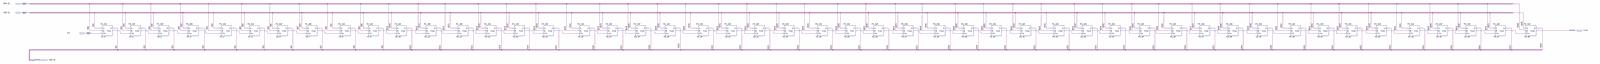
[diagram p0: schematic sheet, whole]
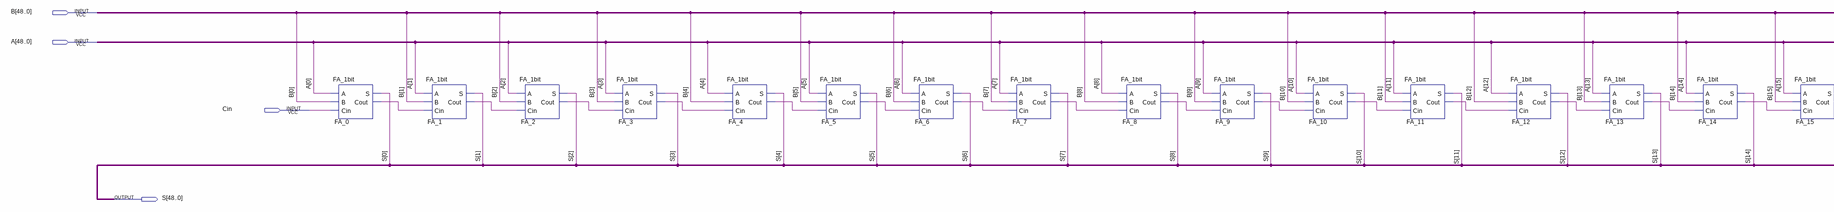
[diagram p1: schematic sheet, left part]
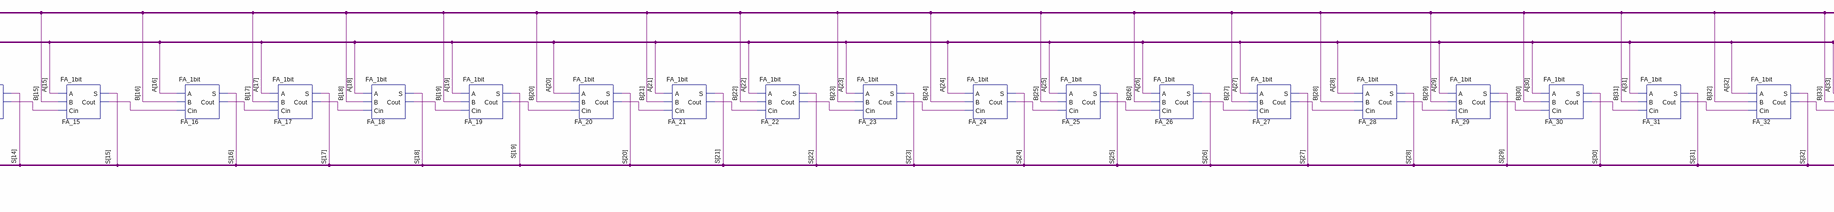
[diagram p2: schematic sheet, centre part]
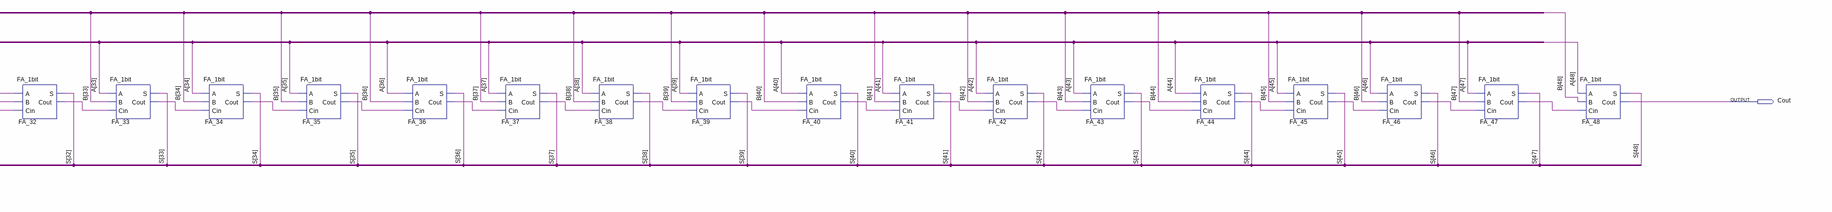
[diagram p3: schematic sheet, right part]
// Quartus schematic FA_49bit.bdf as structural Verilog: 49 symbols, 5 pins
module FA_49bit (
  input  [48:0] B,
  input  [48:0] A,
  input  Cin,
  output Cout,
  output [48:0] S
);

  wire FA_0_cout, FA_1_cout, FA_2_cout, FA_3_cout, FA_4_cout, FA_5_cout, FA_6_cout, FA_7_cout, FA_8_cout,
       FA_9_cout, FA_10_cout, FA_11_cout, FA_12_cout, FA_13_cout, FA_14_cout, FA_15_cout, FA_16_cout,
       FA_17_cout, FA_18_cout, FA_19_cout, FA_20_cout, FA_21_cout, FA_22_cout, FA_23_cout, FA_24_cout,
       FA_25_cout, FA_26_cout, FA_27_cout, FA_28_cout, FA_29_cout, FA_30_cout, FA_31_cout, FA_32_cout,
       FA_33_cout, FA_34_cout, FA_35_cout, FA_36_cout, FA_37_cout, FA_38_cout, FA_39_cout, FA_40_cout,
       FA_41_cout, FA_42_cout, FA_43_cout, FA_44_cout, FA_45_cout, FA_46_cout, FA_47_cout;

  FA_1bit FA_0 (.A(A[0]), .B(B[0]), .Cin(Cin), .S(S[0]), .Cout(FA_0_cout));
  FA_1bit FA_1 (.A(A[1]), .B(B[1]), .Cin(FA_0_cout), .S(S[1]), .Cout(FA_1_cout));
  FA_1bit FA_2 (.A(A[2]), .B(B[2]), .Cin(FA_1_cout), .S(S[2]), .Cout(FA_2_cout));
  FA_1bit FA_3 (.A(A[3]), .B(B[3]), .Cin(FA_2_cout), .S(S[3]), .Cout(FA_3_cout));
  FA_1bit FA_4 (.A(A[4]), .B(B[4]), .Cin(FA_3_cout), .S(S[4]), .Cout(FA_4_cout));
  FA_1bit FA_5 (.A(A[5]), .B(B[5]), .Cin(FA_4_cout), .S(S[5]), .Cout(FA_5_cout));
  FA_1bit FA_6 (.A(A[6]), .B(B[6]), .Cin(FA_5_cout), .S(S[6]), .Cout(FA_6_cout));
  FA_1bit FA_7 (.A(A[7]), .B(B[7]), .Cin(FA_6_cout), .S(S[7]), .Cout(FA_7_cout));
  FA_1bit FA_8 (.A(A[8]), .B(B[8]), .Cin(FA_7_cout), .S(S[8]), .Cout(FA_8_cout));
  FA_1bit FA_9 (.A(A[9]), .B(B[9]), .Cin(FA_8_cout), .S(S[9]), .Cout(FA_9_cout));
  FA_1bit FA_10 (.A(A[10]), .B(B[10]), .Cin(FA_9_cout), .S(S[10]), .Cout(FA_10_cout));
  FA_1bit FA_11 (.A(A[11]), .B(B[11]), .Cin(FA_10_cout), .S(S[11]), .Cout(FA_11_cout));
  FA_1bit FA_12 (.A(A[12]), .B(B[12]), .Cin(FA_11_cout), .S(S[12]), .Cout(FA_12_cout));
  FA_1bit FA_13 (.A(A[13]), .B(B[13]), .Cin(FA_12_cout), .S(S[13]), .Cout(FA_13_cout));
  FA_1bit FA_14 (.A(A[14]), .B(B[14]), .Cin(FA_13_cout), .S(S[14]), .Cout(FA_14_cout));
  FA_1bit FA_15 (.A(A[15]), .B(B[15]), .Cin(FA_14_cout), .S(S[15]), .Cout(FA_15_cout));
  FA_1bit FA_16 (.A(A[16]), .B(B[16]), .Cin(FA_15_cout), .S(S[16]), .Cout(FA_16_cout));
  FA_1bit FA_17 (.A(A[17]), .B(B[17]), .Cin(FA_16_cout), .S(S[17]), .Cout(FA_17_cout));
  FA_1bit FA_18 (.A(A[18]), .B(B[18]), .Cin(FA_17_cout), .S(S[18]), .Cout(FA_18_cout));
  FA_1bit FA_19 (.A(A[19]), .B(B[19]), .Cin(FA_18_cout), .S(S[19]), .Cout(FA_19_cout));
  FA_1bit FA_20 (.A(A[20]), .B(B[20]), .Cin(FA_19_cout), .S(S[20]), .Cout(FA_20_cout));
  FA_1bit FA_21 (.A(A[21]), .B(B[21]), .Cin(FA_20_cout), .S(S[21]), .Cout(FA_21_cout));
  FA_1bit FA_22 (.A(A[22]), .B(B[22]), .Cin(FA_21_cout), .S(S[22]), .Cout(FA_22_cout));
  FA_1bit FA_23 (.A(A[23]), .B(B[23]), .Cin(FA_22_cout), .S(S[23]), .Cout(FA_23_cout));
  FA_1bit FA_24 (.A(A[24]), .B(B[24]), .Cin(FA_23_cout), .S(S[24]), .Cout(FA_24_cout));
  FA_1bit FA_25 (.A(A[25]), .B(B[25]), .Cin(FA_24_cout), .S(S[25]), .Cout(FA_25_cout));
  FA_1bit FA_26 (.A(A[26]), .B(B[26]), .Cin(FA_25_cout), .S(S[26]), .Cout(FA_26_cout));
  FA_1bit FA_27 (.A(A[27]), .B(B[27]), .Cin(FA_26_cout), .S(S[27]), .Cout(FA_27_cout));
  FA_1bit FA_28 (.A(A[28]), .B(B[28]), .Cin(FA_27_cout), .S(S[28]), .Cout(FA_28_cout));
  FA_1bit FA_29 (.A(A[29]), .B(B[29]), .Cin(FA_28_cout), .S(S[29]), .Cout(FA_29_cout));
  FA_1bit FA_30 (.A(A[30]), .B(B[30]), .Cin(FA_29_cout), .S(S[30]), .Cout(FA_30_cout));
  FA_1bit FA_31 (.A(A[31]), .B(B[31]), .Cin(FA_30_cout), .S(S[31]), .Cout(FA_31_cout));
  FA_1bit FA_32 (.A(A[32]), .B(B[32]), .Cin(FA_31_cout), .S(S[32]), .Cout(FA_32_cout));
  FA_1bit FA_33 (.A(A[33]), .B(B[33]), .Cin(FA_32_cout), .S(S[33]), .Cout(FA_33_cout));
  FA_1bit FA_34 (.A(A[34]), .B(B[34]), .Cin(FA_33_cout), .S(S[34]), .Cout(FA_34_cout));
  FA_1bit FA_35 (.A(A[35]), .B(B[35]), .Cin(FA_34_cout), .S(S[35]), .Cout(FA_35_cout));
  FA_1bit FA_36 (.A(A[36]), .B(B[36]), .Cin(FA_35_cout), .S(S[36]), .Cout(FA_36_cout));
  FA_1bit FA_37 (.A(A[37]), .B(B[37]), .Cin(FA_36_cout), .S(S[37]), .Cout(FA_37_cout));
  FA_1bit FA_38 (.A(A[38]), .B(B[38]), .Cin(FA_37_cout), .S(S[38]), .Cout(FA_38_cout));
  FA_1bit FA_39 (.A(A[39]), .B(B[39]), .Cin(FA_38_cout), .S(S[39]), .Cout(FA_39_cout));
  FA_1bit FA_40 (.A(A[40]), .B(B[40]), .Cin(FA_39_cout), .S(S[40]), .Cout(FA_40_cout));
  FA_1bit FA_41 (.A(A[41]), .B(B[41]), .Cin(FA_40_cout), .S(S[41]), .Cout(FA_41_cout));
  FA_1bit FA_42 (.A(A[42]), .B(B[42]), .Cin(FA_41_cout), .S(S[42]), .Cout(FA_42_cout));
  FA_1bit FA_43 (.A(A[43]), .B(B[43]), .Cin(FA_42_cout), .S(S[43]), .Cout(FA_43_cout));
  FA_1bit FA_44 (.A(A[44]), .B(B[44]), .Cin(FA_43_cout), .S(S[44]), .Cout(FA_44_cout));
  FA_1bit FA_45 (.A(A[45]), .B(B[45]), .Cin(FA_44_cout), .S(S[45]), .Cout(FA_45_cout));
  FA_1bit FA_46 (.A(A[46]), .B(B[46]), .Cin(FA_45_cout), .S(S[46]), .Cout(FA_46_cout));
  FA_1bit FA_47 (.A(A[47]), .B(B[47]), .Cin(FA_46_cout), .S(S[47]), .Cout(FA_47_cout));
  FA_1bit FA_48 (.A(A[48]), .B(B[48]), .Cin(FA_47_cout), .S(S[48]), .Cout(Cout));
endmodule
